# Altium schematic sheet IO.SchDoc: I/O
size A3; DrawnBy: Gad; Revision: 0.1v; SheetNumber: 2; SheetTotal: 3; PageTitle: I/O
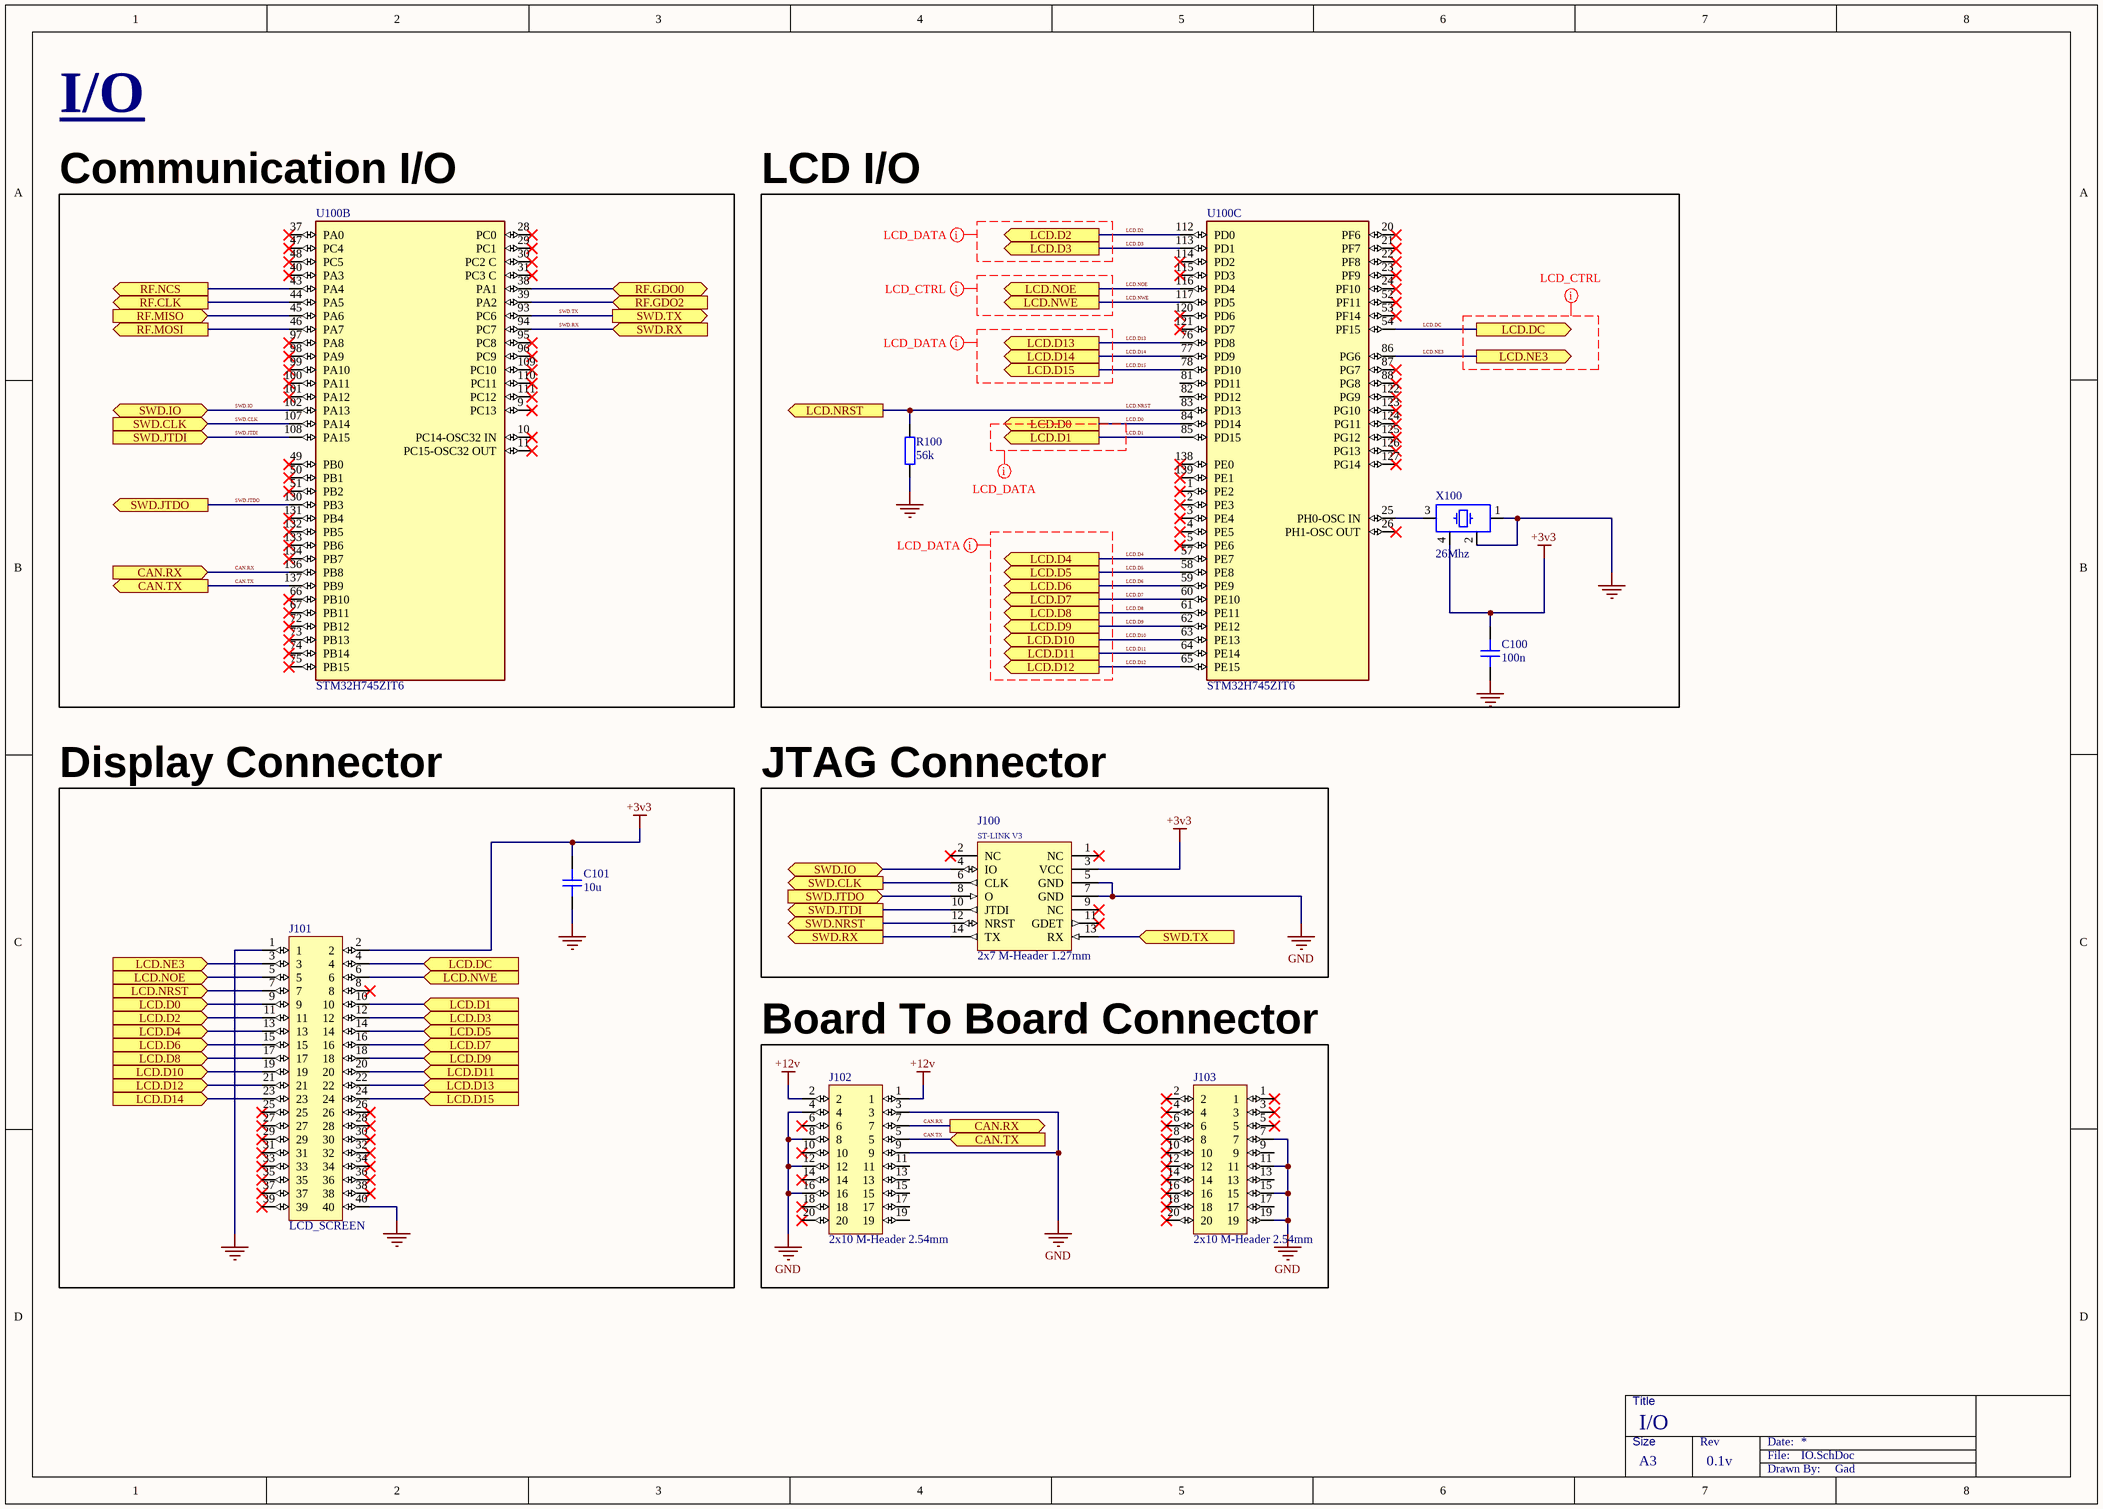
[diagram p0: IO.SchDoc]

## Parts
C100  100n  [CAP_0402]
C101  10u  [CAP_0603]
J100  2x7 M-Header 1.27mm  [2x7 M-Header 1.27mm]
J101  LCD_SCREEN  [LCD_Screen]
J102  2x10 M-Header 2.54mm  [2x10 M-Header 2.54mm]
J103  2x10 M-Header 2.54mm  [2x10 M-Header 2.54mm]
R100  56k  [RES_0402]
U100  STM32H745ZIT6  [FP-LQFP144-1A-MFG]  (parts B,C of 3)
X100  26Mhz  [XTAL_2520]

## Blocks framed on the sheet
Communication I/O: U100
LCD I/O: C100 R100 U100 X100
Display Connector: C101 J101
JTAG Connector: J100
Board To Board Connector: J102 J103

## Ports
CAN.RX (in, see IO[4C]), CAN.RX (out, see IO[1B]), CAN.TX (in, see IO[1B]), CAN.TX (out, see IO[4D]), LCD.D0 (in, see IO[4B]), LCD.D0 (out, see IO[1C]), LCD.D1 (in, see IO[4B]), LCD.D1 (out, see IO[2C]), LCD.D2 (in, see IO[4A]), LCD.D2 (out, see IO[1C]), LCD.D3 (in, see IO[4A]), LCD.D3 (out, see IO[2C]), LCD.D4 (in, see IO[4B]), LCD.D4 (out, see IO[1C]), LCD.D5 (in, see IO[4B]), LCD.D5 (out, see IO[2C]), LCD.D6 (in, see IO[4B]), LCD.D6 (out, see IO[1C]), LCD.D7 (in, see IO[4B]), LCD.D7 (out, see IO[2C]), LCD.D8 (in, see IO[4B]), LCD.D8 (out, see IO[1C]), LCD.D9 (in, see IO[4B]), LCD.D9 (out, see IO[2C]), LCD.D10 (in, see IO[4B]), LCD.D10 (out, see IO[1C]), LCD.D11 (in, see IO[4B]), LCD.D11 (out, see IO[2C]), LCD.D12 (in, see IO[4B]), LCD.D12 (out, see IO[1C]), LCD.D13 (in, see IO[4A]), LCD.D13 (out, see IO[2C]), LCD.D14 (in, see IO[4A]), LCD.D14 (out, see IO[1C]), LCD.D15 (in, see IO[4A]), LCD.D15 (out, see IO[2C]), LCD.DC (in, see IO[6A]), LCD.DC (out, see IO[2C]), LCD.NE3 (in, see IO[6A]), LCD.NE3 (out, see IO[1C]), LCD.NOE (in, see IO[4A]), LCD.NOE (out, see IO[1C]), LCD.NRST (in, see IO[3B]), LCD.NRST (out, see IO[1C]), LCD.NWE (in, see IO[4A]), LCD.NWE (out, see IO[2C]), RF.CLK (out, see RF[5B]), RF.GDO0 (bidir, see RF[3B]), RF.GDO2 (in, see RF[3B]), RF.MISO (in, see RF[5B]), RF.MOSI (out, see RF[5B]), RF.NCS (out, see RF[5A]), SWD.CLK (in, see IO[3C]), SWD.CLK (out, see IO[1B]), SWD.IO (bidir, see IO[1B]), SWD.IO (bidir, see IO[3C]), SWD.JTDI (in, see IO[3C]), SWD.JTDI (out, see IO[1B]), SWD.JTDO (in, see IO[1B]), SWD.JTDO (out, see IO[3C]), SWD.NRST (out, see Power[5B]), SWD.RX (in, see IO[3C]), SWD.RX (out, see IO[3A]), SWD.TX (in, see IO[3A]), SWD.TX (out, see IO[5C])

## Nets
+3v3: C100.1 C101.1 J100.3(VCC) J101.2 X100.4
+12v: J102.1 J102.2
GND: C100.2 C101.2 J100.5(GND) J100.7(GND) J101.1 J101.40 J102.3 J102.4 J102.8 J102.9 J102.12 J102.16 J103.7 J103.11 J103.15 J103.19 R100.1 X100.1 X100.2
CAN.RX: J102.7 U100.136(PB8) ; port CAN.RX
CAN.TX: J102.5 U100.137(PB9) ; port CAN.TX
LCD.D0: J101.9 U100.84(PD14) ; port LCD.D0
LCD.D1: J101.10 U100.85(PD15) ; port LCD.D1
LCD.D2: J101.11 U100.112(PD0) ; port LCD.D2
LCD.D3: J101.12 U100.113(PD1) ; port LCD.D3
LCD.D4: J101.13 U100.57(PE7) ; port LCD.D4
LCD.D5: J101.14 U100.58(PE8) ; port LCD.D5
LCD.D6: J101.15 U100.59(PE9) ; port LCD.D6
LCD.D7: J101.16 U100.60(PE10) ; port LCD.D7
LCD.D8: J101.17 U100.61(PE11) ; port LCD.D8
LCD.D9: J101.18 U100.62(PE12) ; port LCD.D9
LCD.D10: J101.19 U100.63(PE13) ; port LCD.D10
LCD.D11: J101.20 U100.64(PE14) ; port LCD.D11
LCD.D12: J101.21 U100.65(PE15) ; port LCD.D12
LCD.D13: J101.22 U100.76(PD8) ; port LCD.D13
LCD.D14: J101.23 U100.77(PD9) ; port LCD.D14
LCD.D15: J101.24 U100.78(PD10) ; port LCD.D15
LCD.DC: J101.4 U100.54(PF15) ; port LCD.DC
LCD.NE3: J101.3 U100.86(PG6) ; port LCD.NE3
LCD.NOE: J101.5 U100.116(PD4) ; port LCD.NOE
LCD.NRST: J101.7 R100.2 U100.83(PD13) ; port LCD.NRST
LCD.NWE: J101.6 U100.117(PD5) ; port LCD.NWE
RF.CLK: U100.44(PA5) ; port RF.CLK
RF.GDO0: U100.38(PA1) ; port RF.GDO0
RF.GDO2: U100.39(PA2) ; port RF.GDO2
RF.MISO: U100.45(PA6) ; port RF.MISO
RF.MOSI: U100.46(PA7) ; port RF.MOSI
RF.NCS: U100.43(PA4) ; port RF.NCS
SWD.CLK: J100.6(CLK) U100.107(PA14) ; port SWD.CLK
SWD.IO: J100.4(IO) U100.102(PA13) ; port SWD.IO
SWD.JTDI: J100.10(JTDI) U100.108(PA15) ; port SWD.JTDI
SWD.JTDO: J100.8(O) U100.130(PB3) ; port SWD.JTDO
SWD.NRST: J100.12(NRST) ; port SWD.NRST
SWD.RX: J100.14(TX) U100.94(PC7) ; port SWD.RX
SWD.TX: J100.13(RX) U100.93(PC6) ; port SWD.TX
NetU100_25: U100.25(PH0-OSC_IN) X100.3

Not connected (* = marked no-connect by the designer): J100 1(NC)* 2(NC)* 9(NC)* 11(GDET)*; J101 8* 25* 26* 27* 28* 29* 30* 31* 32* 33* 34* 35* 36* 37* 38* 39*; J102 6* 10* 11 13 14* 15 17 18* 19 20*; J103 1* 2* 3* 4* 5* 6* 8* 9 10* 12* 13 14* 16* 17 18* 20*; U100 1(PE2)* 2(PE3)* 3(PE4)* 4(PE5)* 5(PE6)* 9(PC13)* 10(PC14-OSC32_IN)* 11(PC15-OSC32_OUT)* 20(PF6)* 21(PF7)* 22(PF8)* 23(PF9)* 24(PF10)* 26(PH1-OSC_OUT)* 28(PC0)* 29(PC1)* 30(PC2_C)* 31(PC3_C)* 37(PA0)* 40(PA3)* 47(PC4)* 48(PC5)* 49(PB0)* 50(PB1)* 51(PB2)* 52(PF11)* 53(PF14)* 66(PB10)* 67(PB11)* 72(PB12)* 73(PB13)* 74(PB14)* 75(PB15)* 81(PD11) 82(PD12) 87(PG7)* 88(PG8)* 95(PC8)* 96(PC9)* 97(PA8)* 98(PA9)* 99(PA10)* 100(PA11)* 101(PA12)* 109(PC10)* 110(PC11)* 111(PC12)* 114(PD2)* 115(PD3)* 120(PD6)* 121(PD7)* 122(PG9)* 123(PG10)* 124(PG11)* 125(PG12)* 126(PG13)* 127(PG14)* 131(PB4)* 132(PB5)* 133(PB6)* 134(PB7)* 138(PE0)* 139(PE1)*

## Layout directives
net class LCD_DATA: (no net found under the mark), LCD.D0, LCD.D1
net class LCD_CTRL: (no net found under the mark)

## Notes on the sheet
- Title
- Size
- Rev
- Date:
- File:
- A3
- Drawn By:
- (in symbol 2x7 M-Header 1.27mm) ST-LINK V3

## Library data of the parts
C100 = CAP_0402: Capacitor SMD 0402 X7R 50V 10% 100nF; Manufacturer: *; Manufacturer Part Number: *; LCSC: *; Dielectric: *; Distributor Link: *; Rating: *
C101 = CAP_0603: Capacitor SMD 0603 X5R 25V 10% 10uF; Manufacturer: *; Manufacturer Part Number: *; LCSC: *; Dielectric: *; Distributor Link: *; Rating: *
J100 = 2x7 M-Header 1.27mm: ST-LINK v3-minie Connector
R100 = RES_0402: Resistor SMD Thick Film 0402 75V 100mW 1% 56kΩ; Manufacturer: *; Manufacturer Part Number: *; LCSC: *; Distributor Link: *
U100 = CMP-12105-000054-1: HIGH-PERFORMANCE AND DSP WITH DP; Manufacturer: STMicroelectronics; Number Of Timers/Counters: 20; Min Supply Voltage: 1.62V; Frequency: 480MHz; Number Of I2C Channels: 4; Memory Type: FLASH; Number Of I/Os: 97; Number Of Pwm Channels: 42; Number Of Usb Channels: 2; Ram Size: 1MBytes; Memory Size: 2MBytes; Data Bus Width: 32bits; Number Of Adc Channels: 23; Number Of Ethernet Channels: 1; Number Of Uart Channels: 9; Interface: I2C,SPI,UART,USART,CAN,USB,LIN,IrDA,Ethernet,I2S,Other; Number Of A/D Converters: 3; Max Junction Temp: +125°C; Max Supply Voltage: 3.6V; Core Architecture: ARM Cortex-M4, Cortex-M7; Number Of Spi Channels: 6; Standoff Height: 0.05mm; Ambient Temperature Range Low: -40°C; Lead Free: Yes; Manufacturer Part Number: STM32H745ZIT6; Automotive: No; Height: 1.6mm; Device Class L1: Integrated Circuits (ICs); Ambient Temperature Range High: +85°C; RoHS: TRUE; Temperature Range High: +125°C; Temperature: -40°C to +125°C; Category: IC; Device Class L2: Embedded Processors and Controllers; Number Of Cores: 2; Temperature Range Low: -40°C; Octopart: https://octopart.com/stm32h745zit6-stmicroelectronics-100293939; Digikey Description: HIGH-PERFORMANCE AND DSP WITH DP; Package: LQFP144-1A; Device Class L3: Microcontrollers; ComponentLink2URL: https://www.st.com/resource/en/datasheet/stm32h745zi.pdf; ComponentLink2Description: Datasheet
X100 = XTAL_2520: Crystal SMD 2520; Manufacturer Part Number: OW3EL89CENUNFAYLC-26M; Distributor Link: *